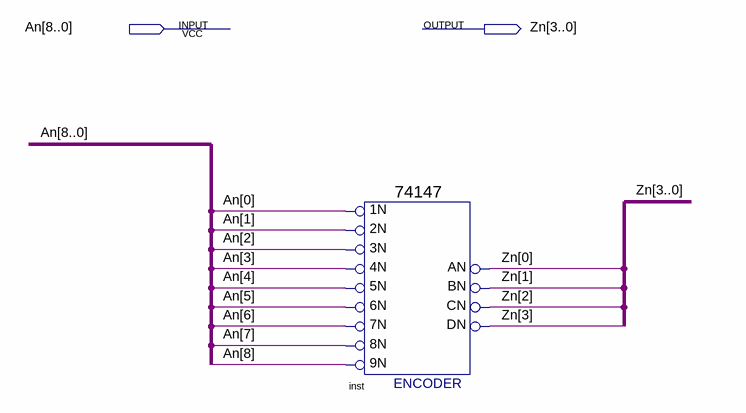
[diagram p0: schematic sheet]
// Quartus schematic ttl74147.bdf as structural Verilog: 1 symbols, 2 pins
module ttl74147 (
  input  [8:0] An,
  output [3:0] Zn
);

  \74147  inst (
    .\1N (An[0]), .\2N (An[1]), .\3N (An[2]), .\6N (An[5]), .\5N (An[4]), .\4N (An[3]), .\9N (An[8]),
    .\8N (An[7]), .\7N (An[6]), .CN(Zn[2]), .BN(Zn[1]), .AN(Zn[0]), .DN(Zn[3]));
endmodule
